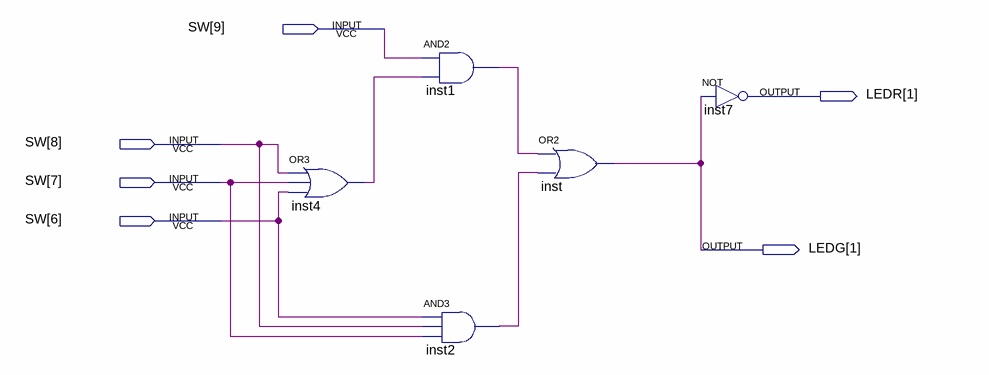
[diagram p0: schematic sheet]
// Quartus schematic Projeto.bdf as structural Verilog: 5 symbols, 6 pins
module Projeto (
  input  [9:6] SW,
  output [1:1] LEDR,
  output [1:1] LEDG
);

  wire inst1_out, inst2_out, inst4_out;

  or inst4 (inst4_out, SW[8], SW[7], SW[6]);
  and inst1 (inst1_out, SW[9], inst4_out);
  and inst2 (inst2_out, SW[6], SW[8], SW[7]);
  or inst (LEDG[1], inst1_out, inst2_out);
  not inst7 (LEDR[1], LEDG[1]);
endmodule
